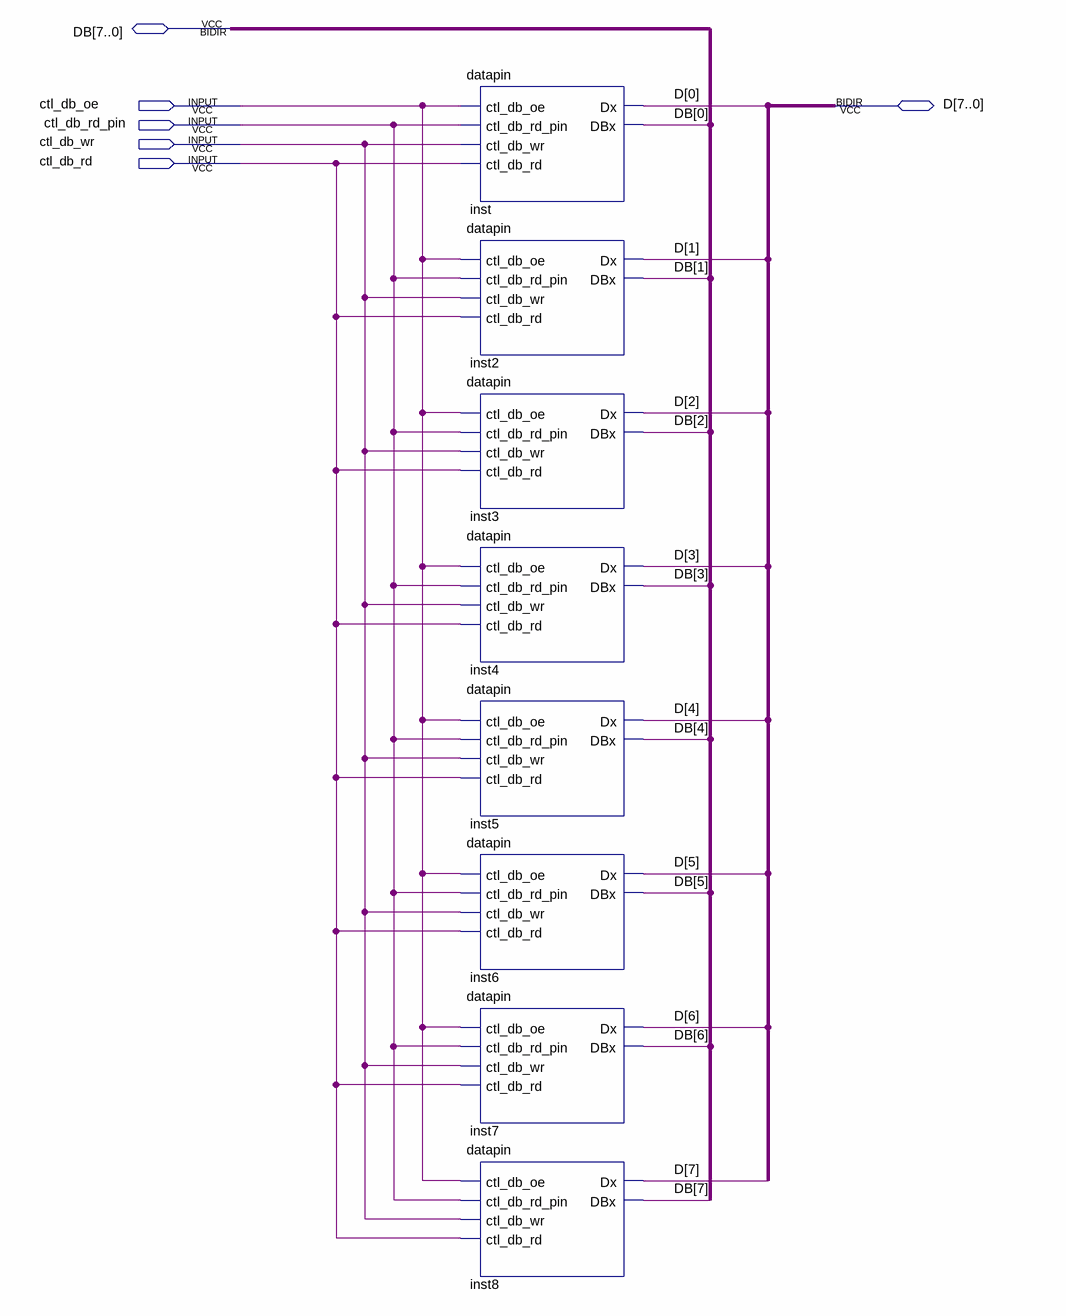
[diagram p0: schematic sheet]
// Quartus schematic databus.bdf as structural Verilog: 8 symbols, 6 pins
module databus (
  input  ctl_db_oe,
  input  ctl_db_rd_pin,
  input  ctl_db_wr,
  input  ctl_db_rd,
  inout  [7:0] DB,
  inout  [7:0] D
);

  datapin inst (
    .ctl_db_oe(ctl_db_oe), .ctl_db_rd_pin(ctl_db_rd_pin), .ctl_db_wr(ctl_db_wr), .ctl_db_rd(ctl_db_rd),
    .Dx(D[0]), .DBx(DB[0]));
  datapin inst2 (
    .ctl_db_oe(ctl_db_oe), .ctl_db_rd_pin(ctl_db_rd_pin), .ctl_db_wr(ctl_db_wr), .ctl_db_rd(ctl_db_rd),
    .Dx(D[1]), .DBx(DB[1]));
  datapin inst3 (
    .ctl_db_oe(ctl_db_oe), .ctl_db_rd_pin(ctl_db_rd_pin), .ctl_db_wr(ctl_db_wr), .ctl_db_rd(ctl_db_rd),
    .Dx(D[2]), .DBx(DB[2]));
  datapin inst4 (
    .ctl_db_oe(ctl_db_oe), .ctl_db_rd_pin(ctl_db_rd_pin), .ctl_db_wr(ctl_db_wr), .ctl_db_rd(ctl_db_rd),
    .Dx(D[3]), .DBx(DB[3]));
  datapin inst5 (
    .ctl_db_oe(ctl_db_oe), .ctl_db_rd_pin(ctl_db_rd_pin), .ctl_db_wr(ctl_db_wr), .ctl_db_rd(ctl_db_rd),
    .Dx(D[4]), .DBx(DB[4]));
  datapin inst6 (
    .ctl_db_oe(ctl_db_oe), .ctl_db_rd_pin(ctl_db_rd_pin), .ctl_db_wr(ctl_db_wr), .ctl_db_rd(ctl_db_rd),
    .Dx(D[5]), .DBx(DB[5]));
  datapin inst7 (
    .ctl_db_oe(ctl_db_oe), .ctl_db_rd_pin(ctl_db_rd_pin), .ctl_db_wr(ctl_db_wr), .ctl_db_rd(ctl_db_rd),
    .Dx(D[6]), .DBx(DB[6]));
  datapin inst8 (
    .ctl_db_oe(ctl_db_oe), .ctl_db_rd_pin(ctl_db_rd_pin), .ctl_db_wr(ctl_db_wr), .ctl_db_rd(ctl_db_rd),
    .Dx(D[7]), .DBx(DB[7]));
endmodule
